# EAGLE design board1 (EAGLE 7.5.0)
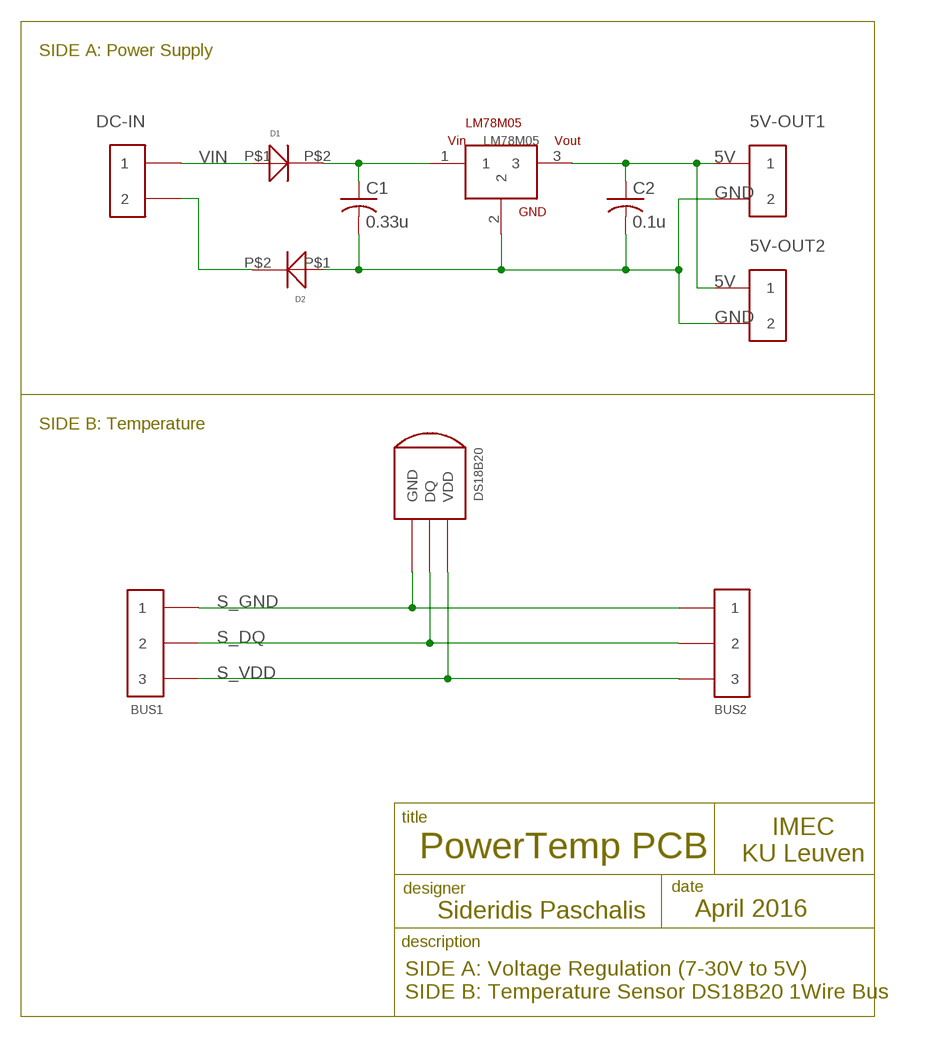
[diagram p0: schematic, sheet 1]

## Parts
5V-OUT1  2PIN-TERMINAL-5MMPITCH  [2PIN-TERMINAL-5MMPITCH]
5V-OUT2  2PIN-TERMINAL-5MMPITCH  [2PIN-TERMINAL-5MMPITCH]
BUS1  AVX-3PIN-SMD-CON  [AVX-3PIN-SMD-CON]
BUS2  AVX-3PIN-SMD-CON  [AVX-3PIN-SMD-CON]
C1  0.33u  C-USC3216  [C3216]
C2  0.1u  C-USC3216  [C3216]
D1  DIODE  [DIODE_PAC]
D2  DIODE  [DIODE_PAC]
DC-IN  2PIN-TERMINAL-5MMPITCH  [2PIN-TERMINAL-5MMPITCH]
DS18B20  SMD-3PAD-DS18B20  [SMD-3PAD-DS18B20]
LM78M05  LM78M05  [LM78M05_PAC]

## Nets
5V: 5V-OUT1.1 5V-OUT2.1 C2.1 LM78M05.3
GND: 5V-OUT1.2 5V-OUT2.2 C1.2 C2.2 D2.P$1 LM78M05.2
N$2: C1.1 D1.P$2 LM78M05.1
N$4: D2.P$2 DC-IN.2
S_DQ: BUS1.P$2 BUS2.P$2 DS18B20.P$2(DQ)
S_GND: BUS1.P$1 BUS2.P$1 DS18B20.P$1(GND)
S_VDD: BUS1.P$3 BUS2.P$3 DS18B20.P$3(VDD)
VIN: D1.P$1 DC-IN.1

## Notes on the sheet
- SIDE A: Power Supply
- SIDE B: Temperature
- title
- PowerTemp PCB
- IMEC
  KU Leuven
- designer | date
- Sideridis Paschalis | April 2016
- description
- SIDE A: Voltage Regulation (7-30V to 5V)
  SIDE B: Temperature Sensor DS18B20 1Wire Bus

## Library data of the parts
5V-OUT1 5V-OUT2 DC-IN = Paschalis_connectors:2PIN-TERMINAL-5MMPITCH
BUS1 BUS2 = Paschalis_connectors:AVX-3PIN-SMD-CON
C1 C2 = adafruit:C-US: CAPACITOR, American symbol
D1 D2 = Bart_educatief_aanbod:DIODE; FARNELL: 4085000RL; GROOTTE: DO-214AC 4.75x2.85mm
DS18B20 = Paschalis_connectors:SMD-3PAD-DS18B20
LM78M05 = Bart_educatief_aanbod:LM78M05

## Board
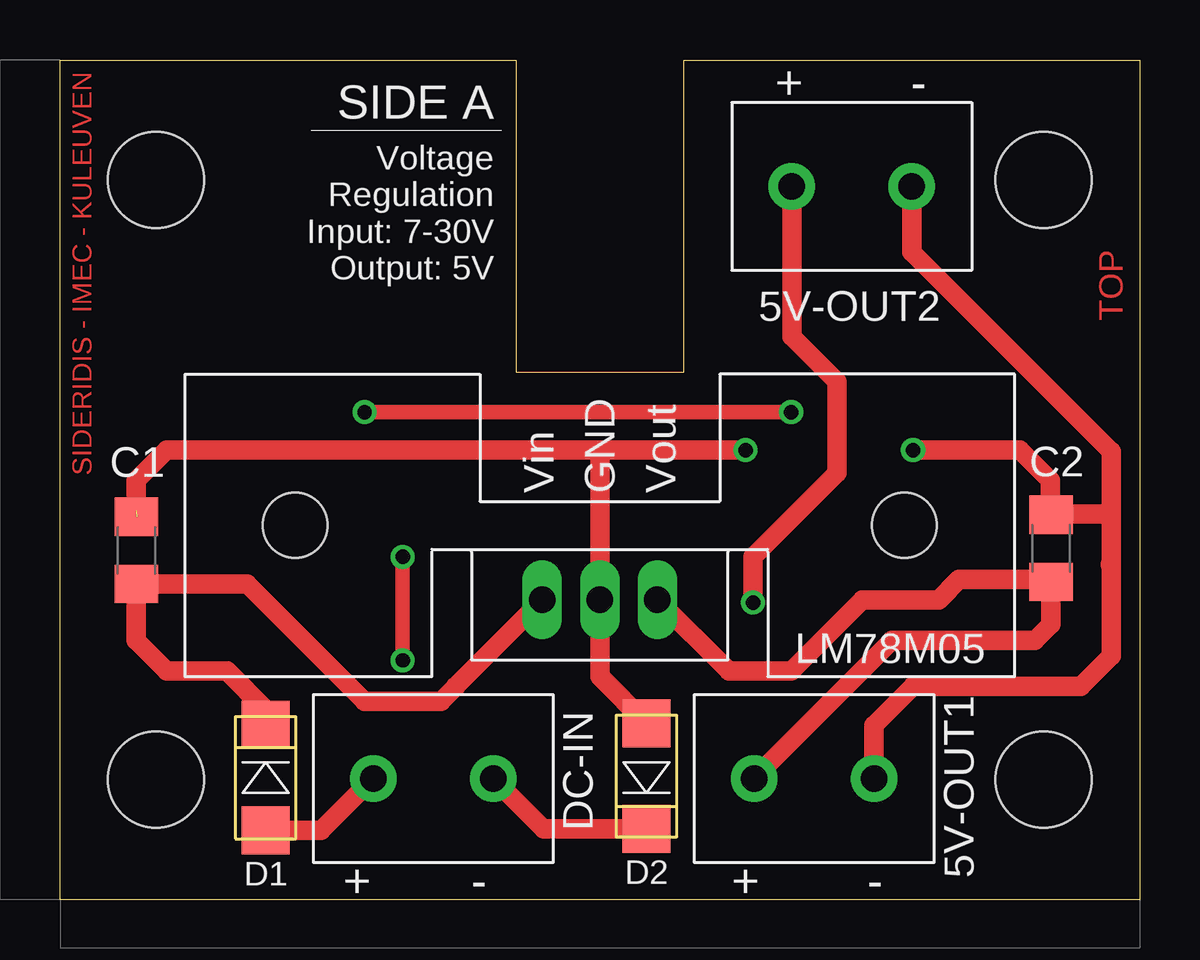
[diagram p1: board, top side]
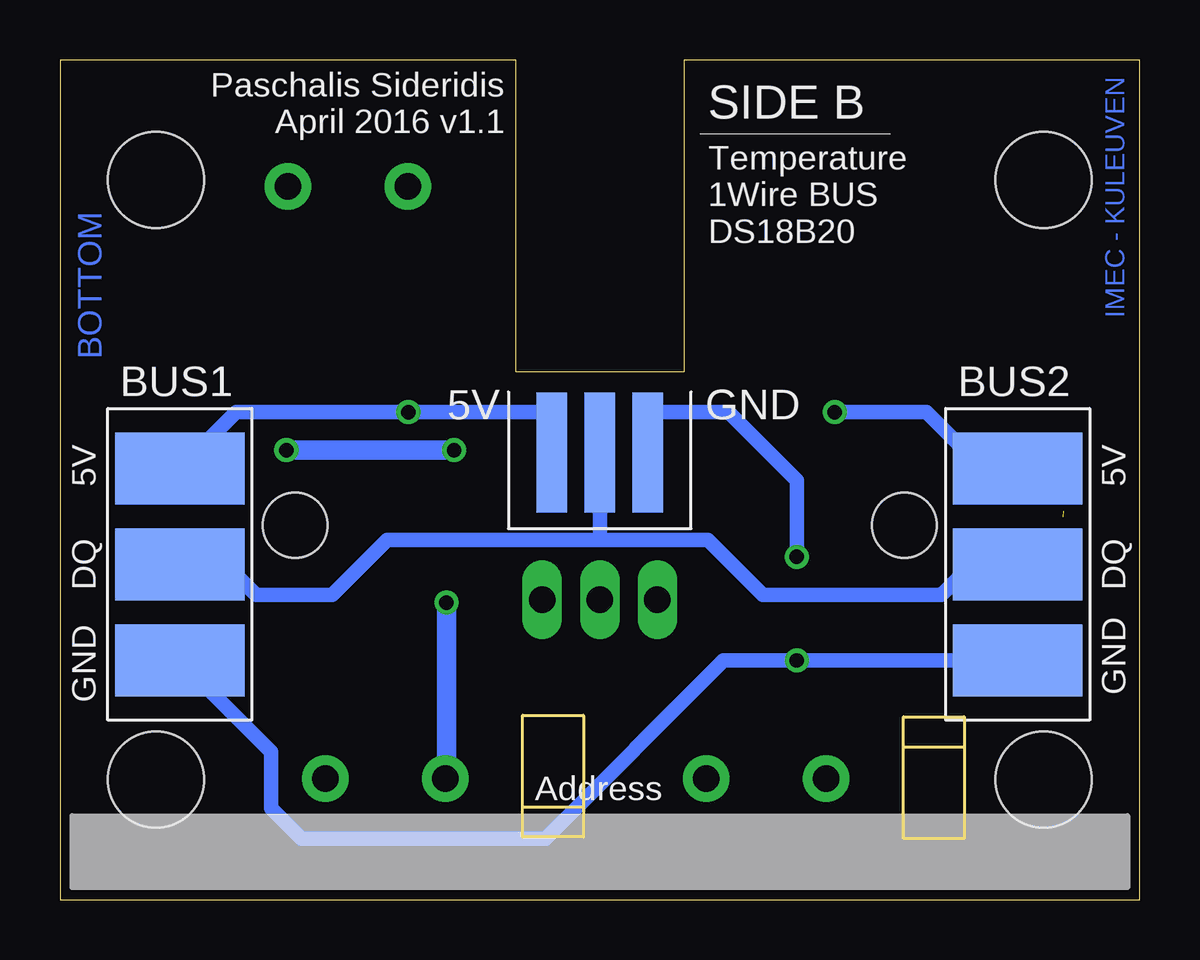
[diagram p2: board, bottom side, seen from below]

Size 45 x 35 mm. Coordinates in mm from the lower left corner, seen from the top.
Outline: 0,0 0,35 19,35 19,22 26,22 26,35 45,35 45,0 0,0
Copper layers (1*16): Top 0.035mm / dielectric 1.5mm / Bottom 0.035mm
Design rules "default *": minimum track width 10mil, minimum drill 24mil, track to track 8mil, track to pad 8mil, pad to pad 8mil, via to via 8mil, smd to smd 8mil, copper to edge 40mil, drill to drill 8mil, minimum pad ring 10mil, minimum via ring 8mil, stop-mask expansion 4mil, vias tented up to drill 25mil, thermal gap 10mil
Holes 4 mm at 4,5 4,30 41,5 41,30

### Footprints (pad centres in the part's own frame; a part is rotated, then mirrored left to right if it is on the bottom)
2PIN-TERMINAL-5MMPITCH = drill 1.1 pad 1.93: 1 -2.5,0; 2 2.5,0
AVX-3PIN-SMD-CON = smd 5.4 x 3: P$1 0,4; P$2 0,0; P$3 0,-4
C3216 = smd 1.6 x 1.8: 1 -1.4,0; 2 1.4,0
DIODE_PAC = smd 2 x 2: P$1 -2.2,0; P$2 2.2,0
SMD-3PAD-DS18B20 = smd 1.27 x 5: P$1 -2,0; P$2 0,0; P$3 2,0
LM78M05_PAC = drill 1.1 long: 1 -2.4,0; 2 0,0; 3 2.4,0 | hole 2.7: -12.7,3.1; 12.7,3.1

### Placement (x,y rotation side)
5V-OUT1  31.43,5.05 0 top
5V-OUT2  33,29.73 0 top
BUS1  40.01,13.97 0 bottom
BUS2  5.08,13.97 0 bottom
C1  3.19,14.55 90 top
C2  41.31,14.64 90 top
D1  8.57,5.08 90 top
D2  24.45,5.14 270 top
DC-IN  15.56,5.05 0 top
DS18B20  22.5,18.64 0 bottom
LM78M05  22.5,12.5 0 top

### Tracks (layer width: path | path; a pad name or v marks a point on that pad's centre or on a via)
5V  (via drill 0.6)
  Top 0.813: 5V-OUT1.1 34.68,10.79 40.64,10.79 41.31,11.46 C2.1 41.22,13.34 37.47,13.34 36.63,12.5 33.45,12.5 30.48,9.53 27.88,9.53 LM78M05.3 | 5V-OUT2.1 30.5,23.48 32.38,21.59 32.38,17.78 28.89,14.29 v28.89,12.38
  Bottom 0.813: v28.89,12.38 28.89,5.05 5V-OUT1.1
GND  (via drill 0.6)  (1 unrouted)
  Top 0.813: 43.81,14 43.81,10.16 42.55,8.89 35.56,8.89 33.93,7.26 5V-OUT1.2 | 43.78,13.97 43.81,14 | 43.81,14 43.81,15.88 | 43.81,15.88 43.81,18.68 35.5,27 5V-OUT2.2 | 22.54,18.73 4.45,18.73 3.17,17.46 3.17,16.19 | 22.54,18.73 v28.57,18.73 | v35.56,18.73 40.01,18.73 41.27,17.46 41.27,16.07 | 41.27,16.07 C2.2 | 41.27,16.07 43.62,16.07 43.81,15.88 | 22.54,18.73 22.5,18.69 LM78M05.2 22.5,9.29 D2.P$1
  Bottom 0.813: v28.57,18.73 v35.56,18.73
N$2
  Top 0.813: LM78M05.1 16.49,8.89 16.49,8.87 15.88,8.26 12.7,8.26 7.8,13.15 C1.1 3.17,13.14 3.17,10.79 4.45,9.53 6.96,9.53 8.57,7.92 D1.P$2
N$4
  Top 0.813: DC-IN.2 20.16,2.94 D2.P$2
S_DQ
  Bottom 0.61: 22.54,15 18,15 15.7,12.7 8.26,12.7 6.99,13.97 BUS2.P$2 | DS18B20.P$2 22.5,15.04 22.54,15 | 22.54,15 31.36,15 33.66,12.7 36.83,12.7 37.47,13.34 39.37,13.34 BUS1.P$2 39.03,13
S_GND  (via drill 0.6)
  Top 0.61: v12.7,20.32 v30.48,20.32
  Bottom 0.61: 24.5,18.61 DS18B20.P$1 | 39.98,18.64 BUS1.P$1 | 24.47,18.61 DS18B20.P$1 | 39.81,18.41 BUS1.P$1 | DS18B20.P$1 24.5,20.32 v30.48,20.32 37.66,20.32 BUS1.P$1 | BUS2.P$1 6.54,17.97 8.89,20.32 v12.7,20.32
S_VDD  (via drill 0.6)
  Top 0.61: v14.29,14.29 v14.29,9.97
  Bottom 0.61: 39.81,10.79 BUS1.P$3 36.2,6.16 36.2,3.81 34.92,2.54 24.77,2.54 17.34,9.97 v14.29,9.97 BUS2.P$3 | v14.29,14.29 14.29,17.46 17.14,20.32 20.5,20.32 DS18B20.P$3
VIN
  Top 0.813: DC-IN.1 10.89,2.88 D1.P$1

### Text on the board
Top: SIDERIDIS - IMEC - KULEUVEN | TOP
Bottom: IMEC - KULEUVEN | BOTTOM
tNames: SIDE A | + | - | Voltage / Regulation / Input: 7-30V / Output: 5V | LM78M05 | + | - | + | -
bNames: SIDE B | Paschalis Sideridis / April 2016 v1.1 | Temperature / 1Wire BUS / DS18B20 | GND | 5V | 5V | 5V | DQ | DQ | GND | GND | Address